# EasyEDA schematic SCH_USB-2.0-KVM-Switch-Hub_2026-04-15.json

## Sheets
1 hosts: TITLE: USB2.0 Hub Switch; REV: 1.0; Date: 2026-01-08; Sheet: 1/1; Drawn By: tobychui; Company: imuslab
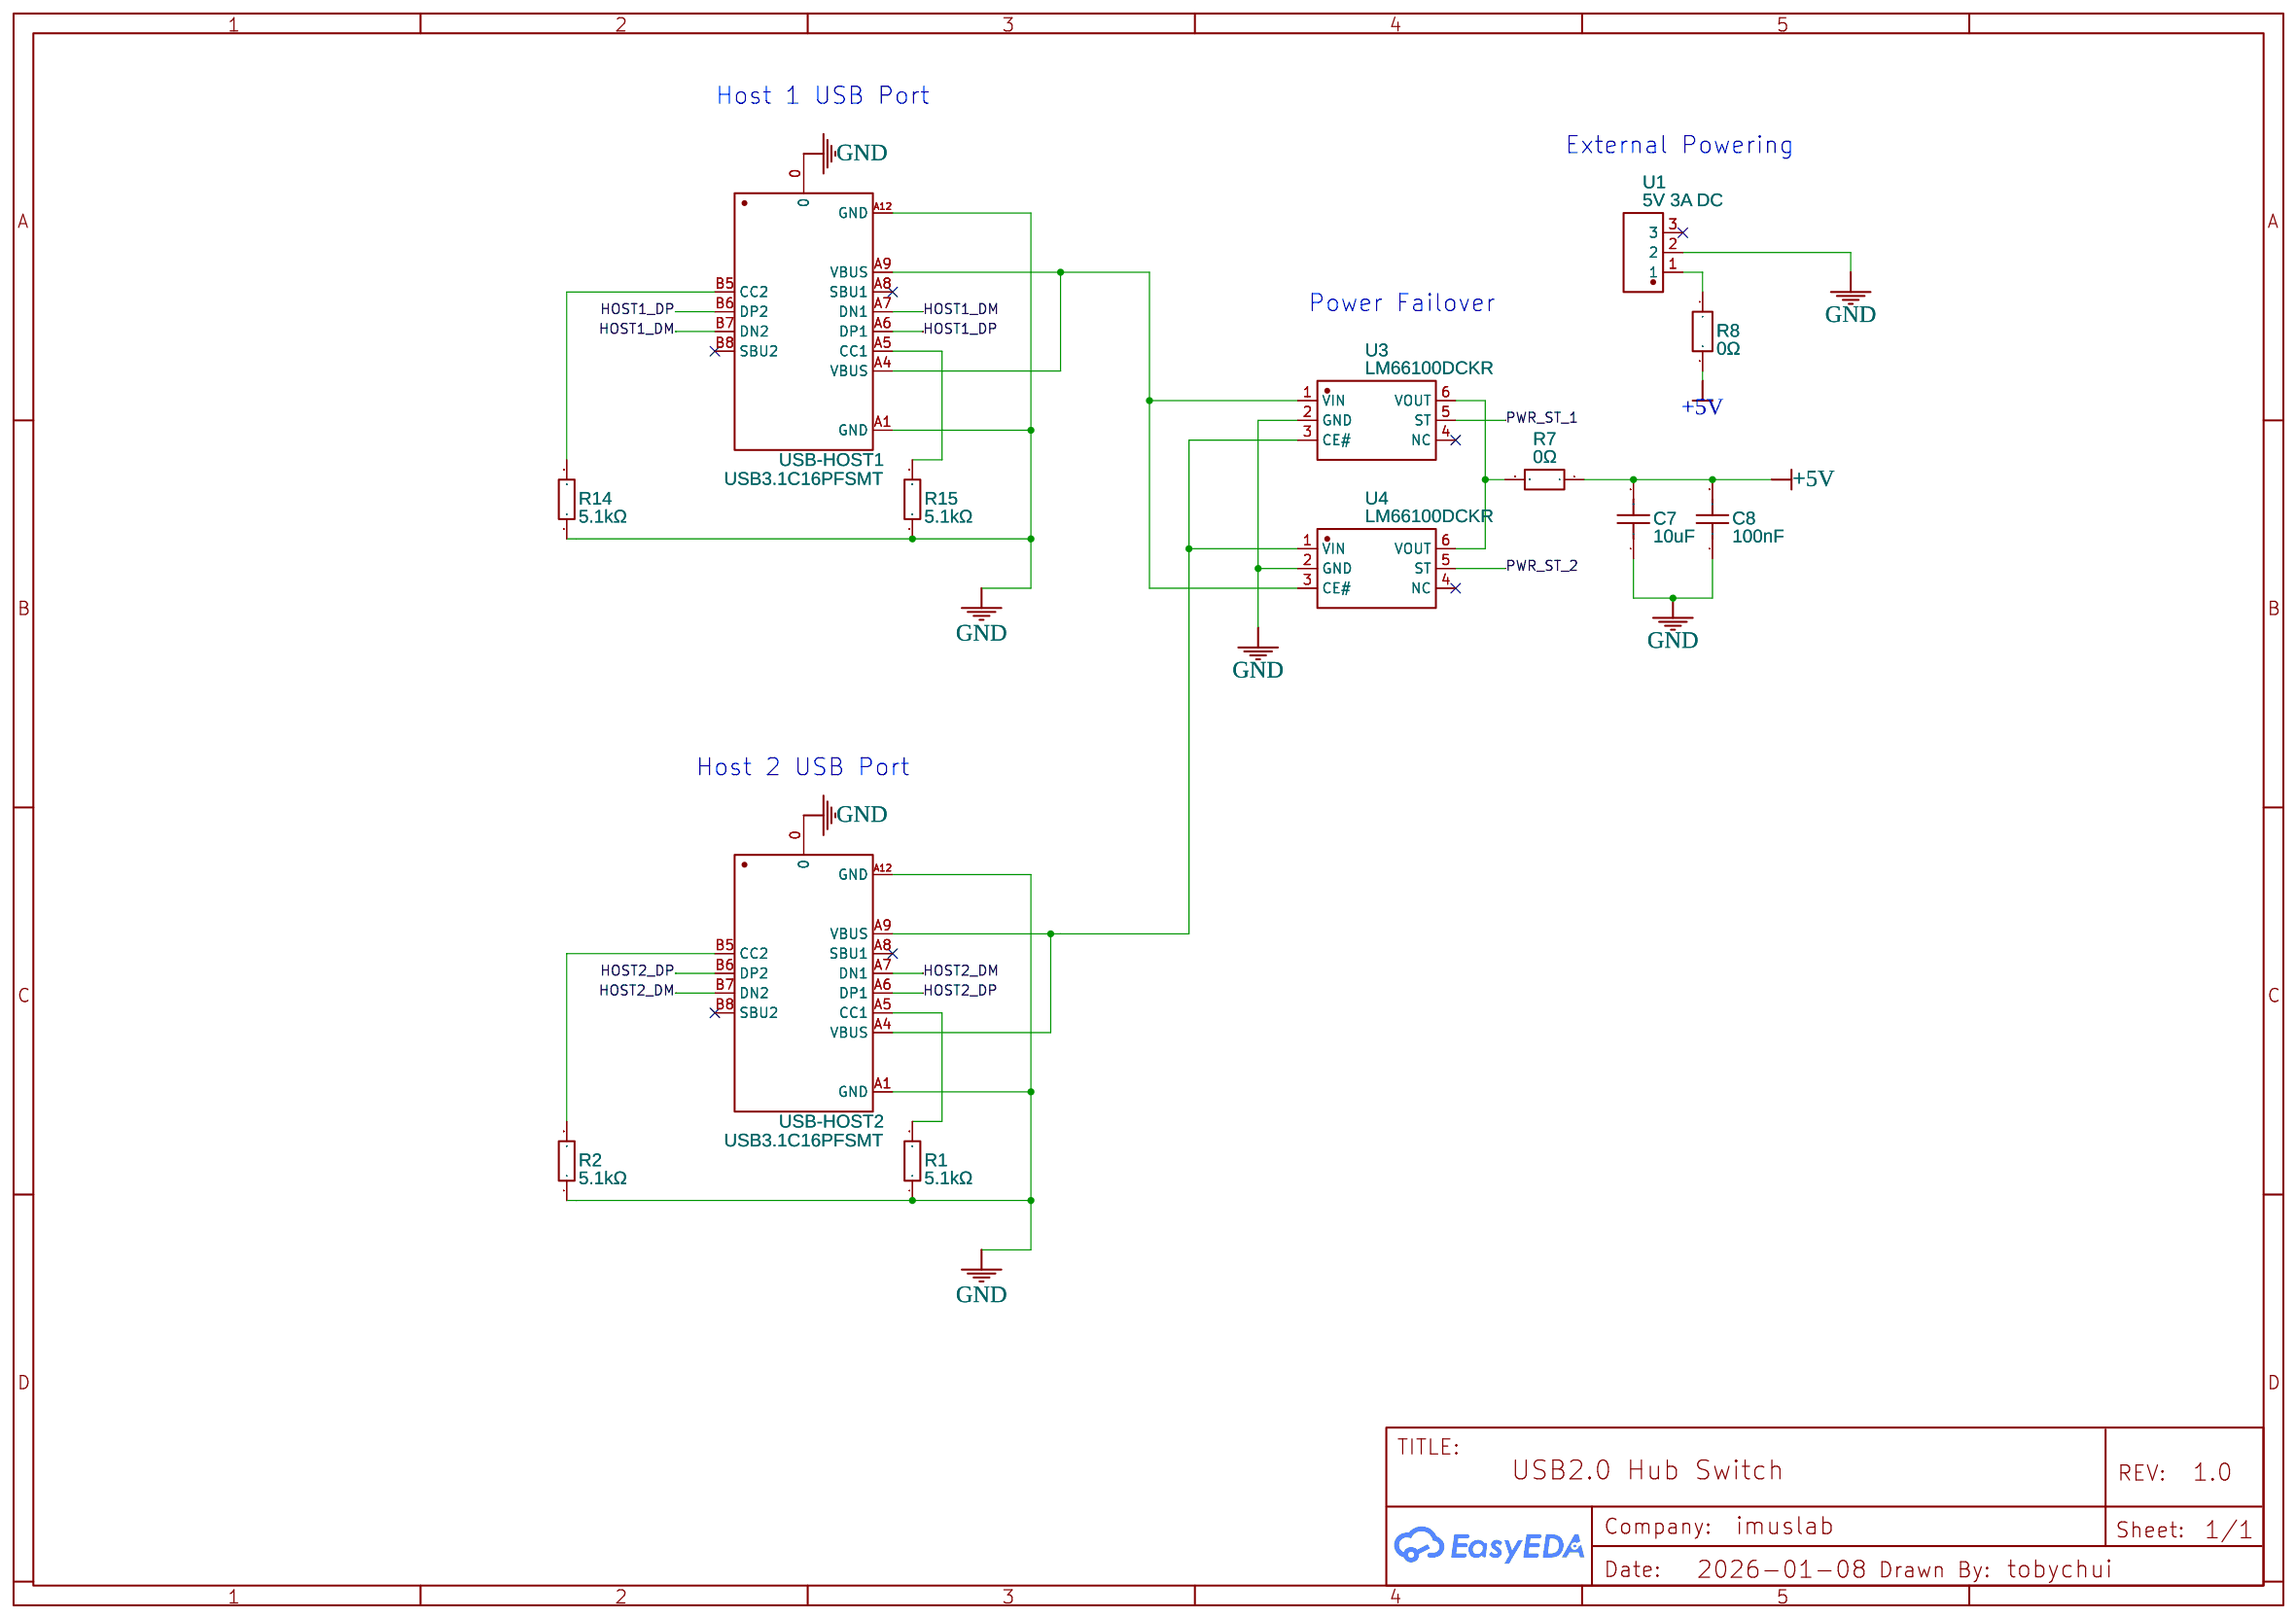
[diagram p0: hosts]
2 usb
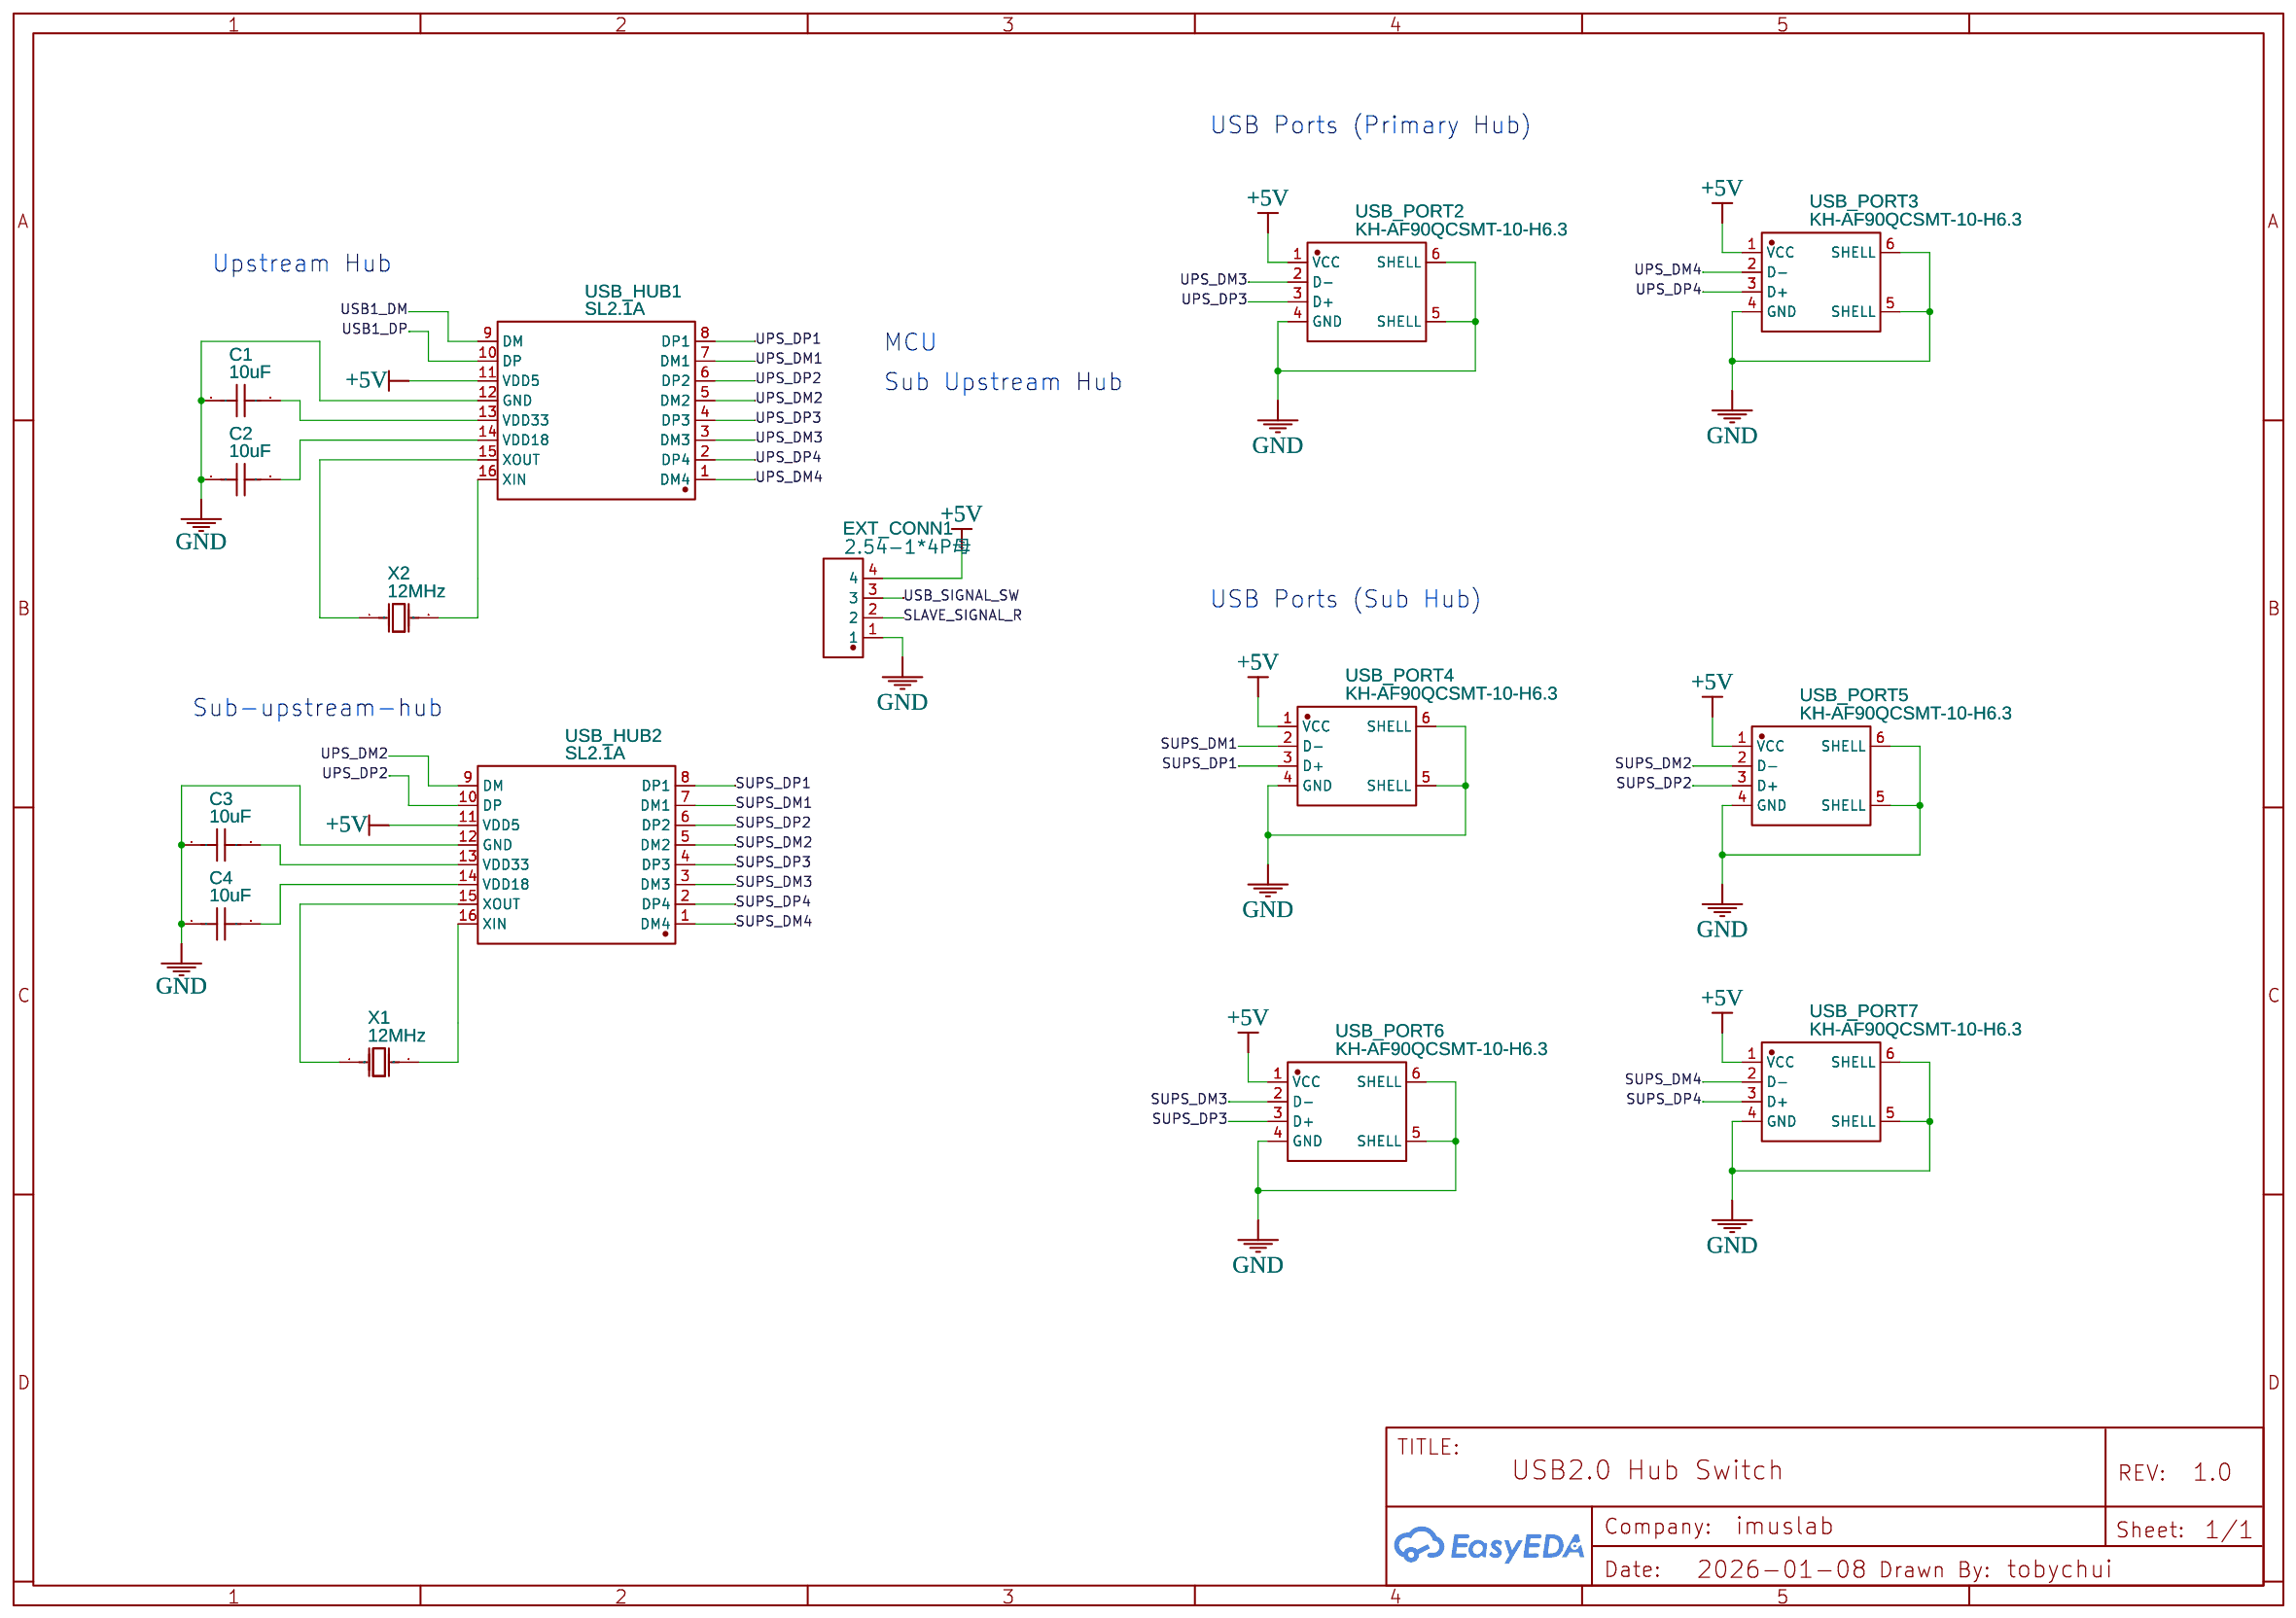
[diagram p1: usb]
3 Switching: Date: 2026-01-11
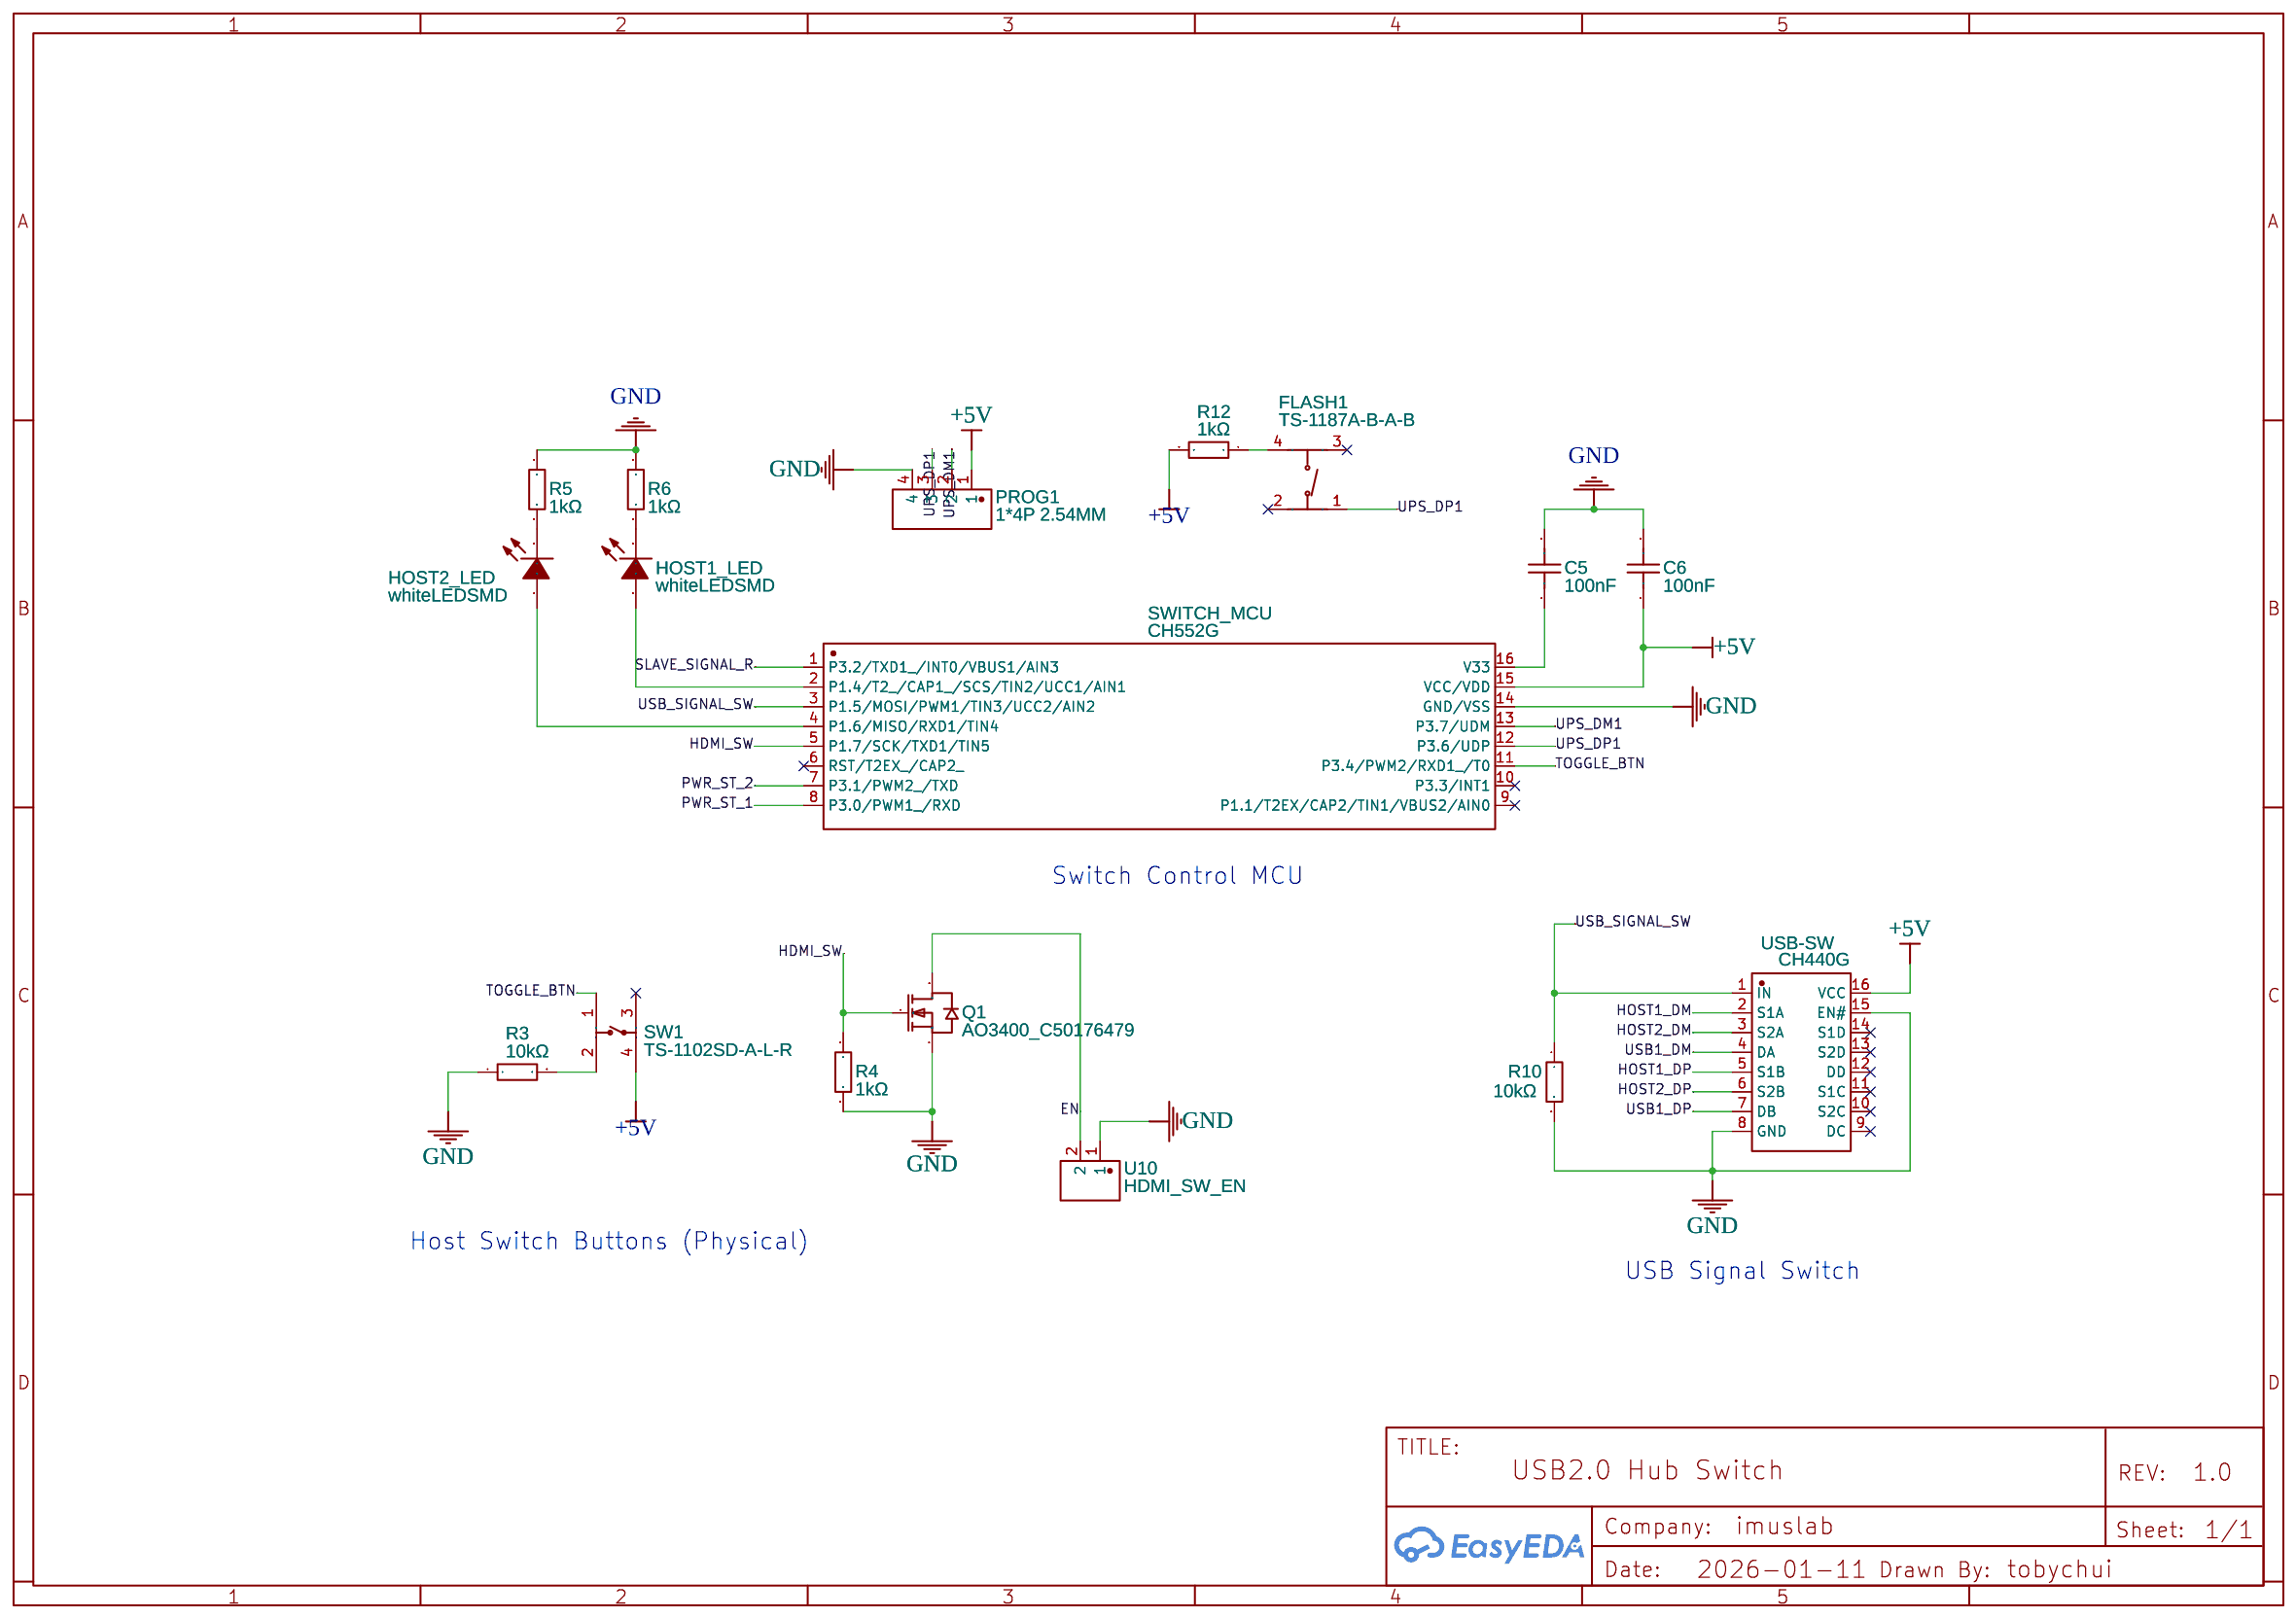
[diagram p2: Switching]

## Parts
sheet hosts
C7  10uF  [C0805]
C8  100nF  [C0805]
R1  5.1kΩ  [R0805]
R2  5.1kΩ  [R0805]
R7  0Ω  [R0805]
R8  0Ω  [R0805]
R14  5.1kΩ  [R0805]
R15  5.1kΩ  [R0805]
U1  5V 3A DC  [DC-IN-TH_HC-DC-007B-2.5]
U3  LM66100DCKR  [SC-70-6_L2.0-W1.3-P0.65-LS2.1-BL]
U4  LM66100DCKR  [SC-70-6_L2.0-W1.3-P0.65-LS2.1-BL]
USB-HOST1  USB3.1C16PFSMT  [USB-C-SMD_TYPE-C-USB-17]
USB-HOST2  USB3.1C16PFSMT  [USB-C-SMD_TYPE-C-USB-17]
sheet Switching
C5  100nF  [C0805]
C6  100nF  [C0805]
FLASH1  TS-1187A-B-A-B  [SW-SMD_4P-L5.1-W5.1-P3.70-LS6.5-TL_H1.5]
HOST1_LED  whiteLEDSMD  [LED0805-R-RD]
HOST2_LED  whiteLEDSMD  [LED0805-R-RD]
PROG1  1*4P 2.54MM  [HDR-TH_4P-P2.54-V-C4_TH-4_2.5X10.5X2.54P]
Q1  AO3400_C50176479  [SOT-23-3_L2.9-W1.6-P1.90-LS2.8-BR]
R3  10kΩ  [R0805]
R4  1kΩ  [R0805]
R5  1kΩ  [R0805]
R6  1kΩ  [R0805]
R10  10kΩ  [R0805]
R12  1kΩ  [R0805]
SW1  TS-1102SD-A-L-R  [SW-SMD_4P-L6.0-W6.0-P4.50-LS9.2]
SWITCH_MCU  CH552G  [SOP-16_L10.0-W3.9-P1.27-LS6.0-BL]
U10  HDMI_SW_EN  [HDR-TH_2P-P2.54-V-F-4]
USB-SW  CH440G  [SOP-16_L10.0-W3.9-P1.27-LS6.0-BL]
sheet usb
C1  10uF  [C0805]
C2  10uF  [C0805]
C3  10uF  [C0805]
C4  10uF  [C0805]
EXT_CONN1  2.54-1*4P母  [HDR-TH_4P-P2.54-V-F]
USB_HUB1  SL2.1A  [SOP-16_L10.0-W3.9-P1.27-LS6.0-BL]
USB_HUB2  SL2.1A  [SOP-16_L10.0-W3.9-P1.27-LS6.0-BL]
USB_PORT2  KH-AF90QCSMT-10-H6.3  [USB-A-SMD_KH-AF90QCSMT-10-H6.3]
USB_PORT3  KH-AF90QCSMT-10-H6.3  [USB-A-SMD_KH-AF90QCSMT-10-H6.3]
USB_PORT4  KH-AF90QCSMT-10-H6.3  [USB-A-SMD_KH-AF90QCSMT-10-H6.3]
USB_PORT5  KH-AF90QCSMT-10-H6.3  [USB-A-SMD_KH-AF90QCSMT-10-H6.3]
USB_PORT6  KH-AF90QCSMT-10-H6.3  [USB-A-SMD_KH-AF90QCSMT-10-H6.3]
USB_PORT7  KH-AF90QCSMT-10-H6.3  [USB-A-SMD_KH-AF90QCSMT-10-H6.3]
X1  12MHz  [OSC-SMD_L5.0-W3.2]
X2  12MHz  [OSC-SMD_L5.0-W3.2]

## Library data of the parts
C1-C4 C7 = CL21A106KAYNNNE: Supplier: LCSC; Manufacturer: SAMSUNG(三星); Supplier Part: C15850; JLCPCB Part Class: Basic Part
C5 C6 C8 = CC0805KRX7R9BB104: Supplier: LCSC; Manufacturer: YAGEO(国巨); Supplier Part: C49678; JLCPCB Part Class: Basic Part
R1 R2 R14 R15 = 0805W8F5101T5E: Supplier: LCSC; Manufacturer: UNI-ROYAL(厚声); Supplier Part: C27834; JLCPCB Part Class: Basic Part
R7 R8 = YLRY05-W2-0Z: Supplier: LCSC; Supplier Part: C22468035; Manufacturer: yezhan(业展); Contributor: lcsc; JLCPCB Part Class: Extended Part
U1 = HC-DC-007B-2.5: Contributor: lcsc; Supplier: LCSC; Supplier Part: C3010538; Manufacturer: HCTL(华灿天禄); JLCPCB Part Class: Extended Part; link: https://lcsc.com/eda_search?q=C3010538&%26type=1&ref=editor
U3 U4 = LM66100DCKR: Contributor: LCSC; Supplier: LCSC; Supplier Part: C2869734; Manufacturer: TI(德州仪器); JLCPCB Part Class: Extended Part
USB-HOST1 USB-HOST2 = USB3.1C16PFSMT: Contributor: LCSC; Supplier: LCSC; Supplier Part: C167321; Manufacturer: 精拓金; Manufacturer Part: 918-418K2023S40001; JLCPCB Part Class: Extended Part
FLASH1 = TS-1187A-B-A-B: Contributor: LCSC; Supplier: LCSC; Supplier Part: C318884; Manufacturer: XKB Connectivity(中国星坤); JLCPCB Part Class: Basic Part
HOST1_LED HOST2_LED = whiteLEDSMD: Supplier: LCSC; Manufacturer: KENTO; Manufacturer Part: KT-0805W; Supplier Part: C34499; JLCPCB Part Class: Basic Part
PROG1 = 1*4P 2.54MM: Contributor: LCSC; Supplier: LCSC; Supplier Part: C2887121; Manufacturer: null; Manufacturer Part: 单排直插排针 1*4P 2.54mm; JLCPCB Part Class: Extended Part
Q1 = AO3400_C50176479: Supplier: LCSC; Supplier Part: C50176479; Manufacturer: SEP(威旺); Manufacturer Part: AO3400; Contributor: lcsc; JLCPCB Part Class: Extended Part
R3 R10 = 0805W8F1002T5E: Supplier: LCSC; Manufacturer: UNI-ROYAL(厚声); Supplier Part: C17414; JLCPCB Part Class: Basic Part
R4-R6 R12 = 0805W8F1001T5E: Supplier: LCSC; Manufacturer: UNI-ROYAL(厚声); Supplier Part: C17513; JLCPCB Part Class: Basic Part
SW1 = TS-1102SD-A-L-R: Contributor: lcsc; Supplier: LCSC; Supplier Part: C3010212; Manufacturer: XKB Connection(中国星坤); JLCPCB Part Class: Extended Part
SWITCH_MCU = CH552G: Supplier: LCSC; Manufacturer: WCH(南京沁恒); Supplier Part: C111292; JLCPCB Part Class: Extended Part
U10 = 254PM-1X2P-V: Supplier: LCSC; Supplier Part: C53202175; Manufacturer: LXWCONN(连兴旺电子); Manufacturer Part: 254PM-1x2P-V; Contributor: lcsc; JLCPCB Part Class: Extended Part
USB-SW = CH440G: Supplier: LCSC; Manufacturer: WCH(南京沁恒); Supplier Part: C88324; JLCPCB Part Class: Extended Part
EXT_CONN1 = 2.54-1*4P母: Contributor: LCSC; Supplier: LCSC; Supplier Part: C2718488; Manufacturer: BOOMELE(博穆精密); JLCPCB Part Class: Extended Part
USB_HUB1 USB_HUB2 = SL2.1A: Contributor: LCSC; Supplier: LCSC; Supplier Part: C192893; Manufacturer: CoreChips(和芯润德); JLCPCB Part Class: Extended Part
USB_PORT2-USB_PORT7 = KH-AF90QCSMT-10-H6.3: Contributor: lcsc; Supplier: LCSC; Supplier Part: C2979063; Manufacturer: kinghelm(金航标); JLCPCB Part Class: Extended Part
X1 X2 = X503212MSD2GI: Supplier: LCSC; Manufacturer: YXC(扬兴晶振); Supplier Part: C114436; JLCPCB Part Class: Extended Part

## Nets
+5V: C6.1 C7.2 C8.2 EXT_CONN1.4 PROG1.1 R7.1 R8.2 R12.2 SW1.4 SWITCH_MCU.15(VCC/VDD) USB-SW.16(VCC) USB_HUB1.11(VDD5) USB_HUB2.11(VDD5) USB_PORT2.1(VCC) USB_PORT3.1(VCC) USB_PORT4.1(VCC) USB_PORT5.1(VCC) USB_PORT6.1(VCC) USB_PORT7.1(VCC)
GND: C1.1 C2.1 C3.1 C4.1 C5.2 C6.2 C7.1 C8.1 EXT_CONN1.1 PROG1.4 Q1.2(S) R1.1 R2.1 R3.1 R4.2 R5.1 R6.1 R10.2 R14.1 R15.1 SWITCH_MCU.14(GND/VSS) U1.2 U3.2(GND) U4.2(GND) U10.1 USB-HOST1.0 USB-HOST1.A1(GND) USB-HOST1.A12(GND) USB-HOST2.0 USB-HOST2.A1(GND) USB-HOST2.A12(GND) USB-SW.8(GND) USB-SW.15(EN#) USB_HUB1.12(GND) USB_HUB2.12(GND) USB_PORT2.4(GND) USB_PORT2.5(SHELL) USB_PORT2.6(SHELL) USB_PORT3.4(GND) USB_PORT3.5(SHELL) USB_PORT3.6(SHELL) USB_PORT4.4(GND) USB_PORT4.5(SHELL) USB_PORT4.6(SHELL) USB_PORT5.4(GND) USB_PORT5.5(SHELL) USB_PORT5.6(SHELL) USB_PORT6.4(GND) USB_PORT6.5(SHELL) USB_PORT6.6(SHELL) USB_PORT7.4(GND) USB_PORT7.5(SHELL) USB_PORT7.6(SHELL)
EN: Q1.3(D) U10.2
HDMI_SW: Q1.1(G) R4.1 SWITCH_MCU.5(P1.7/SCK/TXD1/TIN5)
HOST1_DM: USB-HOST1.A7(DN1) USB-HOST1.B7(DN2) USB-SW.2(S1A)
HOST1_DP: USB-HOST1.A6(DP1) USB-HOST1.B6(DP2) USB-SW.5(S1B)
HOST2_DM: USB-HOST2.A7(DN1) USB-HOST2.B7(DN2) USB-SW.3(S2A)
HOST2_DP: USB-HOST2.A6(DP1) USB-HOST2.B6(DP2) USB-SW.6(S2B)
PWR_ST_1: SWITCH_MCU.8(P3.0/PWM1_/RXD) U3.5(ST)
PWR_ST_2: SWITCH_MCU.7(P3.1/PWM2_/TXD) U4.5(ST)
SLAVE_SIGNAL_R: EXT_CONN1.2 SWITCH_MCU.1(P3.2/TXD1_/INT0/VBUS1/AIN3)
SUPS_DM1: USB_HUB2.7(DM1) USB_PORT4.2(D-)
SUPS_DM2: USB_HUB2.5(DM2) USB_PORT5.2(D-)
SUPS_DM3: USB_HUB2.3(DM3) USB_PORT6.2(D-)
SUPS_DM4: USB_HUB2.1(DM4) USB_PORT7.2(D-)
SUPS_DP1: USB_HUB2.8(DP1) USB_PORT4.3(D+)
SUPS_DP2: USB_HUB2.6(DP2) USB_PORT5.3(D+)
SUPS_DP3: USB_HUB2.4(DP3) USB_PORT6.3(D+)
SUPS_DP4: USB_HUB2.2(DP4) USB_PORT7.3(D+)
TOGGLE_BTN: SW1.1 SWITCH_MCU.11(P3.4/PWM2/RXD1_/T0)
UPS_DM1: PROG1.2 SWITCH_MCU.13(P3.7/UDM) USB_HUB1.7(DM1)
UPS_DM2: USB_HUB1.5(DM2) USB_HUB2.9(DM)
UPS_DM3: USB_HUB1.3(DM3) USB_PORT2.2(D-)
UPS_DM4: USB_HUB1.1(DM4) USB_PORT3.2(D-)
UPS_DP1: FLASH1.1(A) PROG1.3 SWITCH_MCU.12(P3.6/UDP) USB_HUB1.8(DP1)
UPS_DP2: USB_HUB1.6(DP2) USB_HUB2.10(DP)
UPS_DP3: USB_HUB1.4(DP3) USB_PORT2.3(D+)
UPS_DP4: USB_HUB1.2(DP4) USB_PORT3.3(D+)
USB1_DM: USB-SW.4(DA) USB_HUB1.9(DM)
USB1_DP: USB-SW.7(DB) USB_HUB1.10(DP)
USB_SIGNAL_SW: EXT_CONN1.3 R10.1 SWITCH_MCU.3(P1.5/MOSI/PWM1/TIN3/UCC2/AIN2) USB-SW.1(IN)
Net-(C1-2): C1.2 USB_HUB1.13(VDD33)
Net-(C2-2): C2.2 USB_HUB1.14(VDD18)
Net-(C3-2): C3.2 USB_HUB2.13(VDD33)
Net-(C4-2): C4.2 USB_HUB2.14(VDD18)
Net-(C5-1): C5.1 SWITCH_MCU.16(V33)
Net-(FLASH1-4): FLASH1.4(D) R12.1
Net-(HOST1_LED-1): HOST1_LED.1(A) SWITCH_MCU.2(P1.4/T2_/CAP1_/SCS/TIN2/UCC1/AIN1)
Net-(HOST1_LED-2): HOST1_LED.2(K) R6.2
Net-(HOST2_LED-1): HOST2_LED.1(A) SWITCH_MCU.4(P1.6/MISO/RXD1/TIN4)
Net-(HOST2_LED-2): HOST2_LED.2(K) R5.2
Net-(R1-2): R1.2 USB-HOST2.A5(CC1)
Net-(R2-2): R2.2 USB-HOST2.B5(CC2)
Net-(R3-2): R3.2 SW1.2
Net-(R7-2): R7.2 U3.6(VOUT) U4.6(VOUT)
Net-(R8-1): R8.1 U1.1
Net-(R14-2): R14.2 USB-HOST1.B5(CC2)
Net-(R15-2): R15.2 USB-HOST1.A5(CC1)
Net-(U3-1): U3.1(VIN) U4.3(CE#) USB-HOST1.A4(VBUS) USB-HOST1.A9(VBUS)
Net-(U3-3): U3.3(CE#) U4.1(VIN) USB-HOST2.A4(VBUS) USB-HOST2.A9(VBUS)
Net-(USB_HUB1-15): USB_HUB1.15(XOUT) X2.1(OSC1)
Net-(USB_HUB1-16): USB_HUB1.16(XIN) X2.2(OSC2)
Net-(USB_HUB2-15): USB_HUB2.15(XOUT) X1.1(OSC1)
Net-(USB_HUB2-16): USB_HUB2.16(XIN) X1.2(OSC2)

Not connected (* = marked no-connect by the designer): FLASH1 2(B)* 3(C)*; SW1 3*; SWITCH_MCU 6(RST/T2EX_/CAP2_)* 9(P1.1/T2EX/CAP2/TIN1/VBUS2/AIN0)* 10(P3.3/INT1)*; U1 3*; U3 4(NC)*; U4 4(NC)*; USB-HOST1 A8(SBU1)* B8(SBU2)*; USB-HOST2 A8(SBU1)* B8(SBU2)*; USB-SW 9(DC)* 10(S2C)* 11(S1C)* 12(DD)* 13(S2D)* 14(S1D)*

## Notes on the sheets
sheet 1
- Host 1 USB Port
- External Powering
- Power Failover
- Host 2 USB Port
sheet 2
- USB Ports (Primary Hub)
- Upstream Hub
- MCU
- Sub Upstream Hub
- USB Ports (Sub Hub)
- Sub-upstream-hub
sheet 3
- Switch Control MCU
- Host Switch Buttons (Physical)
- USB Signal Switch
